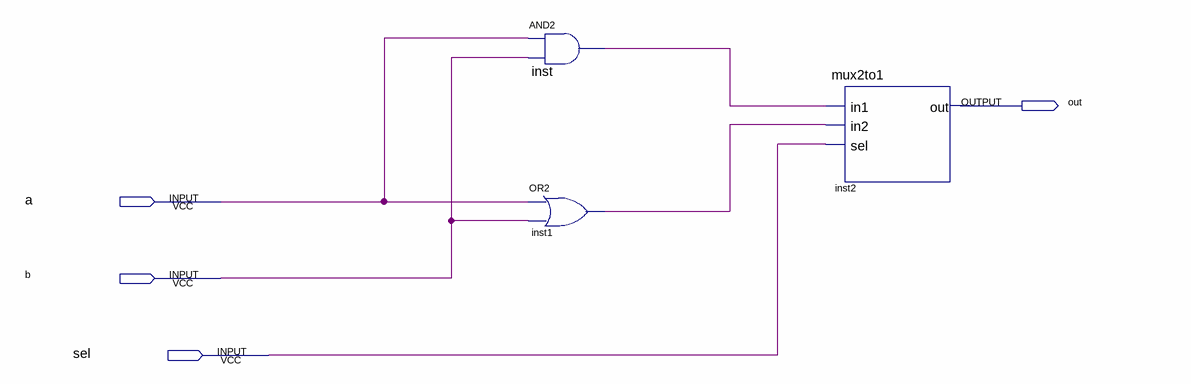
[diagram p0: schematic sheet]
// Quartus schematic gateTest.bdf as structural Verilog: 3 symbols, 4 pins
module gateTest (
  input  a,
  input  b,
  input  sel,
  output out
);

  wire inst1_out, inst_out;

  and inst (inst_out, a, b);
  or inst1 (inst1_out, a, b);
  mux2to1 inst2 (.in1(inst_out), .in2(inst1_out), .sel(sel), .out(out));
endmodule
